# EAGLE schematic untitled (EAGLE 9.3.0)
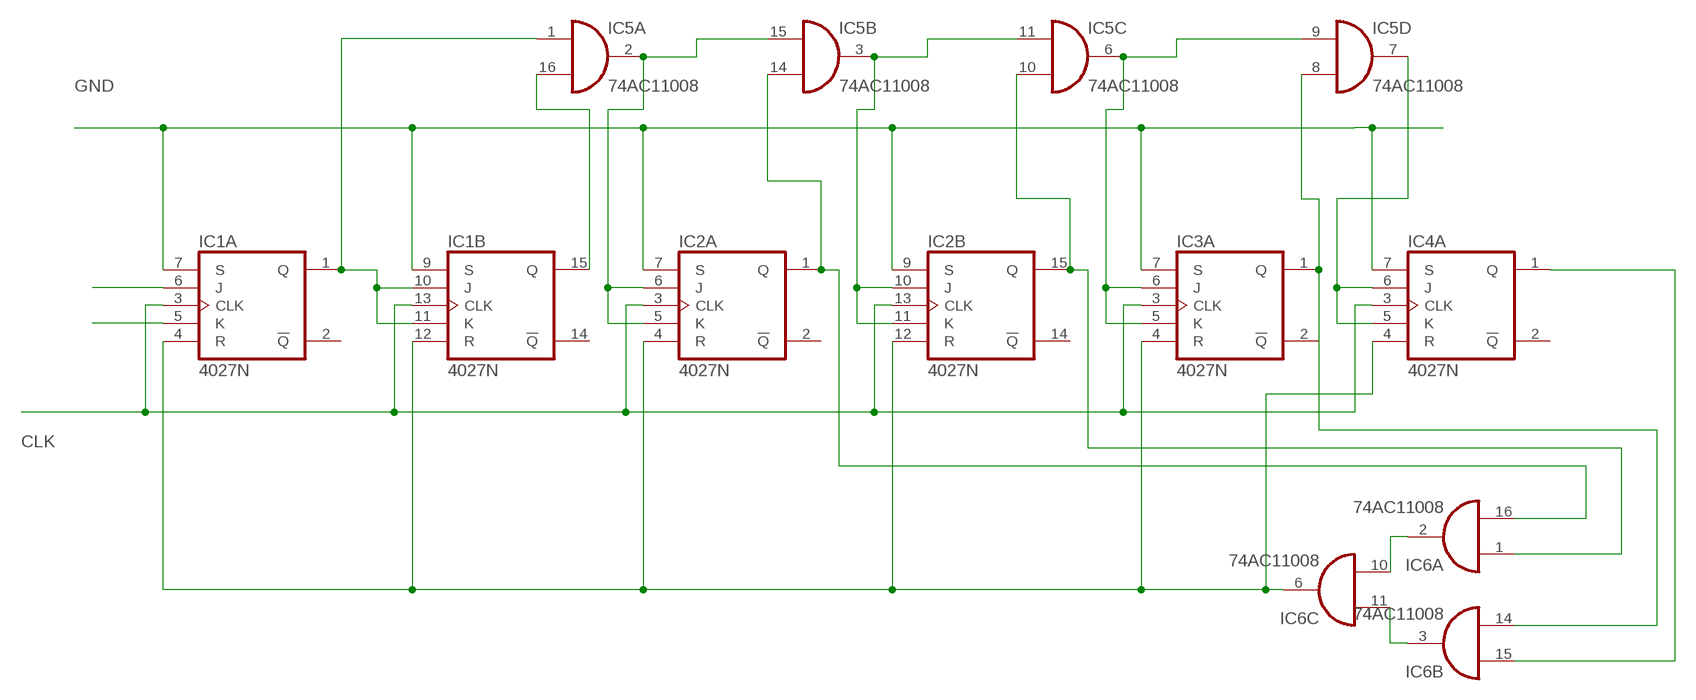
[diagram p0: schematic, sheet 1]

## Parts
IC1  4027N  [DIL16]
IC2  4027N  [DIL16]
IC3  4027N  [DIL16]
IC4  4027N  [DIL16]
IC5  74AC11008  [DIL16]
IC6  74AC11008  [DIL16]

## Nets
CLK: IC1.3(A:CLK) IC1.13(B:CLK) IC2.3(A:CLK) IC2.13(B:CLK) IC3.3(A:CLK) IC4.3(A:CLK)
GND: IC1.7(A:S) IC1.9(B:S) IC2.7(A:S) IC2.9(B:S) IC3.7(A:S) IC4.7(A:S)
N$1: IC1.1(A:Q) IC1.10(B:J) IC1.11(B:K) IC5.1(A:I0)
N$2: IC2.1(A:Q) IC5.14(B:I1) IC6.16(A:I1)
N$3: IC1.15(B:Q) IC5.16(A:I1)
N$4: IC2.5(A:K) IC2.6(A:J) IC5.2(A:O) IC5.15(B:I0)
N$5: IC2.10(B:J) IC2.11(B:K) IC5.3(B:O) IC5.11(C:I0)
N$6: IC3.5(A:K) IC3.6(A:J) IC5.6(C:O) IC5.9(D:I0)
N$7: IC2.15(B:Q) IC5.10(C:I1) IC6.1(A:I0)
N$8: IC3.1(A:Q) IC3.2(A:!Q) IC5.8(D:I1) IC6.14(B:I1)
N$9: IC4.5(A:K) IC4.6(A:J) IC5.7(D:O)
N$10: IC4.1(A:Q) IC6.15(B:I0)
N$11: IC1.6(A:J)
N$12: IC1.5(A:K)
N$13: IC6.2(A:O) IC6.10(C:I1)
N$14: IC6.3(B:O) IC6.11(C:I0)
N$15: IC1.4(A:R) IC1.12(B:R) IC2.4(A:R) IC2.12(B:R) IC3.4(A:R) IC4.4(A:R) IC6.6(C:O)
Unconnected: IC1.2(A:!Q) IC1.14(B:!Q) IC2.2(A:!Q) IC2.14(B:!Q) IC3.9(B:S) IC3.10(B:J) IC3.11(B:K) IC3.12(B:R) IC3.13(B:CLK) IC3.14(B:!Q) IC3.15(B:Q) IC4.2(A:!Q) IC4.9(B:S) IC4.10(B:J) IC4.11(B:K) IC4.12(B:R) IC4.13(B:CLK) IC4.14(B:!Q) IC4.15(B:Q) IC6.7(D:O) IC6.8(D:I1) IC6.9(D:I0)

## Power pins joined to a net without a drawn wire
GND: IC5.4(P:GND) IC5.5(P:GND) IC6.4(P:GND) IC6.5(P:GND)
VCC: IC5.12(P:VCC) IC5.13(P:VCC) IC6.12(P:VCC) IC6.13(P:VCC)
VDD: IC1.16(P:VDD) IC2.16(P:VDD) IC3.16(P:VDD) IC4.16(P:VDD)
VSS: IC1.8(P:VSS) IC2.8(P:VSS) IC3.8(P:VSS) IC4.8(P:VSS)

## Library data of the parts
IC1-IC4 = 40xx:4027: Dual JK FLIP FLOP
IC5 IC6 = 74ac-logic:74AC11008: Quadruple 2-input AND